# Altium project UM-1.PrjPcb
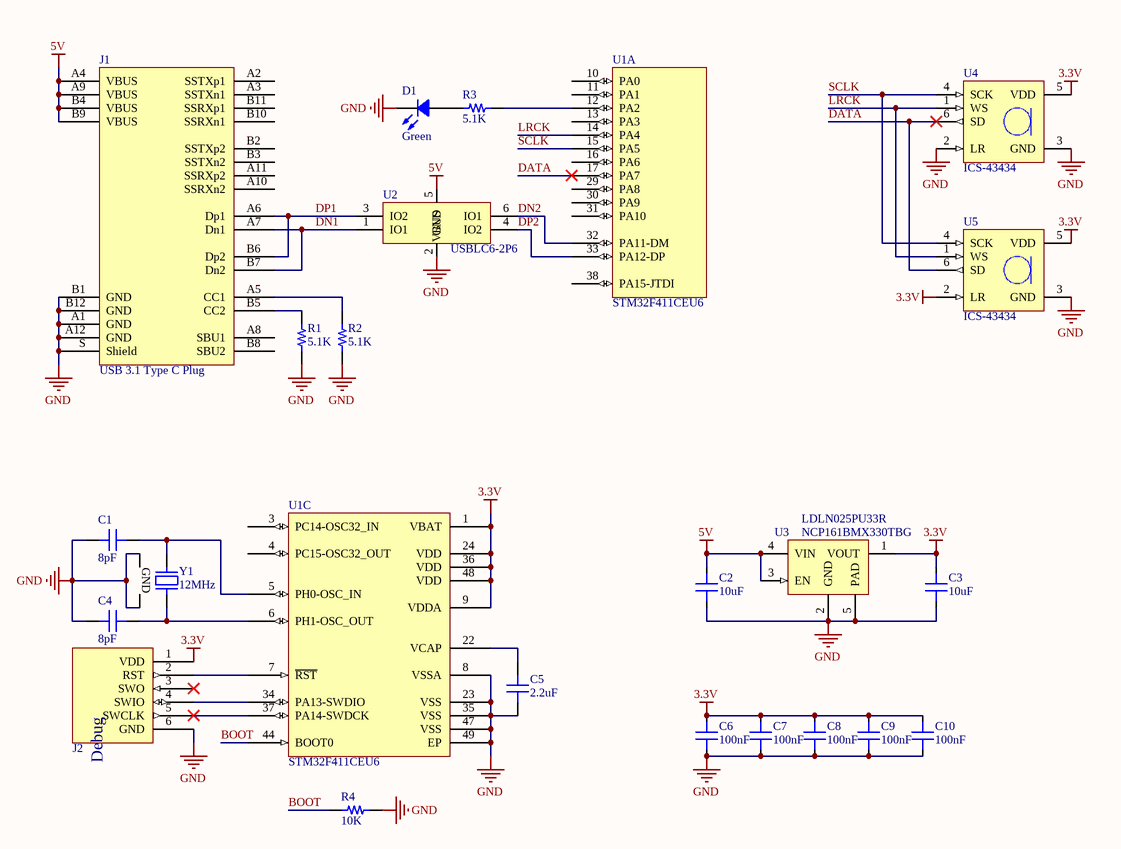
[diagram p0: UM-1.SchDoc]
1 sheet, 23 parts. Net scope: global (net labels, ports and power ports of the same name join across sheets).
Board file: UM-1.PcbDoc

## Sheet UM-1.SchDoc: UM-1
size A4; Organization: OGGA SAS; Address1: 96 Bd Marius Vivier Merle; Address2: 69003 Lyon; Address3: France; SheetNumber: 1; SheetTotal: 1

### Parts
C1  8pF  [CAP 0402/1005]
C2  10uF  [CAP 0603/1608]
C3  10uF  [CAP 0603/1608]
C4  8pF  [CAP 0402/1005]
C5  2.2uF  [CAP 0402/1005]
C6  100nF  [CAP 0402/1005]
C7  100nF  [CAP 0402/1005]
C8  100nF  [CAP 0402/1005]
C9  100nF  [CAP 0402/1005]
C10  100nF  [CAP 0402/1005]
D1  Green  [LED 0402/1005 GREEN]
J1  USB 3.1 Type C Plug  [632712000112]
J2  SWD Port  [DBG_6PX127 SMD]  (value not drawn)  (no BOM)
R1  5.1K  [RES 0402/1005]
R2  5.1K  [RES 0402/1005]
R3  5.1K  [RES 0402/1005]
R4  10K  [RES 0402/1005]
U1  STM32F411CEU6  [QFN50P700X700X60_HS-49N]  (parts A,C of 3)
U2  USBLC6-2P6  [SOTFL50P160X60-6N]
U3  LDLN025PU33R  Alt Part: NCP161BMX330TBG  [XDFN65P100X45-4N]
U4  ICS-43434  [TDK ICS-43434]
U5  ICS-43434  [TDK ICS-43434]
Y1  12MHz  [NDK NZ2520SD]

### Nets
3.3V: C3.2 C6.2 C7.2 C8.2 C9.2 C10.2 J2.1(VDD) U1.1(VBAT) U1.9(VDDA) U1.24(VDD) U1.36(VDD) U1.48(VDD) U3.1(VOUT) U4.5(VDD) U5.2(LR) U5.5(VDD)
5V: C2.2 J1.A4(VBUS) J1.A9(VBUS) J1.B4(VBUS) J1.B9(VBUS) U2.5(VBUS) U3.3(EN) U3.4(VIN)
GND: C1.1 C2.1 C3.1 C4.1 C5.1 C6.1 C7.1 C8.1 C9.1 C10.1 D1.2 J1.A1(GND) J1.A12(GND) J1.B1(GND) J1.B12(GND) J1.S(Shield) J2.6(GND) R1.1 R2.1 R4.2 U1.8(VSSA) U1.23(VSS) U1.35(VSS) U1.47(VSS) U1.49(EP) U2.2(GND) U3.2(GND) U3.5(PAD) U4.2(LR) U4.3(GND) U5.3(GND) Y1.2(GND) Y1.4(GND)
BOOT: R4.1 U1.44(BOOT0)
DATA: U1.17(PA7) U4.6(SD) U5.6(SD)
DN1: J1.A7(Dn1) J1.B7(Dn2) U2.1(IO1)
DN2: U1.32(PA11-DM) U2.6(IO1)
DP1: J1.A6(Dp1) J1.B6(Dp2) U2.3(IO2)
DP2: U1.33(PA12-DP) U2.4(IO2)
LRCK: U1.14(PA4) U4.1(WS) U5.1(WS)
SCLK: U1.15(PA5) U4.4(SCK) U5.4(SCK)
NetC1_2: C1.2 U1.5(PH0-OSC_IN) Y1.1
NetC4_2: C4.2 U1.6(PH1-OSC_OUT) Y1.3
NetC5_2: C5.2 U1.22(VCAP)
NetD1_1: D1.1 R3.2
NetJ1_A5: J1.A5(CC1) R2.2
NetJ1_B5: J1.B5(CC2) R1.2
NetJ2_2: J2.2(RST) U1.7(~{RST})
NetJ2_4: J2.4(SWIO) U1.34(PA13-SWDIO)
NetJ2_5: J2.5(SWCLK) U1.37(PA14-SWDCK)
NetR3_1: R3.1 U1.12(PA2)

Not connected (* = marked no-connect by the designer): J1 A2(SSTXp1) A3(SSTXn1) A8(SBU1) A10(SSRXn2) A11(SSRXp2) B2(SSTXp2) B3(SSTXn2) B8(SBU2) B10(SSRXn1) B11(SSRXp1); J2 3(SWO)*; U1 3(PC14-OSC32_IN) 4(PC15-OSC32_OUT) 10(PA0) 11(PA1) 13(PA3) 16(PA6) 29(PA8) 30(PA9) 31(PA10) 38(PA15-JTDI)

### Notes on the sheet
- Title
- Size:
- Date:
- A4
- Number:
- Time:
- Revision:
- Sheet
- of
- File:
- (in symbol SWD Port) Debug

### Library data of the parts
C1 C4 = CM0143: CAP CER 8PF 50V NP0 0402; Part Number: GRM1555C1H8R0BA01D; Manufacturer: Murata; TemperatureRange: -55C ~ 125C; TemperatureCoefficient: C0G, NP0; Tolerance: 0.1pF; PartId: CM0143; Value: 8pF; Supplier 1: Digi-Key; Supplier Part Number 1: 490-8230-2-ND; ComponentLink1Description: Datasheet; ComponentLink1URL: http://www.murata.com/~/media/webrenewal/support/library/catalog/products/capacitor/mlcc/c02e.ashx; ComponentLink2Description: Digi-Key listing; ComponentLink2URL: http://digikey.com/product-detail/en/GRM1555C1H8R0BA01D/490-8230-2-ND/3694033; Voltage: 50V; Price: 0.0108; Type: -; Device Package: 0402 (1005 Metric)
C2 C3 = CM0905: CAP CER 10UF 25V X5R 0603; Part Number: GRM188R61E106MA73D; Manufacturer: Murata; TemperatureRange: -55C ~ 85C; Tolerance: 20%; Value: 10uF; PartId: CM0905; Supplier 1: Digi-Key; Supplier Part Number 1: 490-7202-2-ND; ComponentLink1Description: Datasheet; ComponentLink1URL: http://www.murata.com/~/media/webrenewal/support/library/catalog/products/capacitor/mlcc/c02e.pdf; ComponentLink2Description: Digi-Key Listing; ComponentLink2URL: https://www.digikey.com/product-detail/en/murata-electronics-north-america/GRM188R61E106MA73D/490-7202-2-ND/3900497; TemperatureCoefficient: X5R; Voltage: 25V; Price: 0.0858; Device Package: 0603 (1608 Metric)
C5 = CM0503: CAP CER 2.2UF 10V X5R 0402; Part Number: GRM155R61A225ME95D; Manufacturer: Murata Electronics North America; TemperatureRange: -55C ~ 85C; Tolerance: 20%; va: 2200000; Value: 2.2uF; PartId: CM0503; Supplier 1: Digi-Key; Supplier Part Number 1: 490-10452-2-ND; ComponentLink1Description: Datasheet; ComponentLink1URL: http://www.murata.com/~/media/webrenewal/support/library/catalog/products/capacitor/mlcc/c02e.pdf; ComponentLink2Description: Digi-Key Listing; ComponentLink2URL: https://www.digikey.com/product-detail/en/murata-electronics-north-america/GRM155R61A225ME95D/490-10452-2-ND/5027537; TemperatureCoefficient: X5R; Voltage: 10V; Price: 0.0151; Device Package: 0402 (1005 Metric)
C6-C10 = CM0464: CAP CER 100NF 25V X5R 0402; Part Number: GRM155R61E104KA87D; Manufacturer: Murata; TemperatureRange: -55C ~ 85C; Tolerance: 10%; PartId: CM0464; Value: 100nF; Supplier 1: Digi-Key; Supplier Part Number 1: 490-5920-2-ND; ComponentLink1Description: Datasheet; ComponentLink1URL: http://www.murata.com/~/media/webrenewal/support/library/catalog/products/capacitor/mlcc/c02e.pdf; TemperatureCoefficient: X5R; Voltage: 25V; Price: 0.0048; Device Package: 0402 (1005 Metric); ComponentLink2Description: Digi-Key Listing; ComponentLink2URL: https://www.digikey.com/product-detail/en/murata-electronics-north-america/GRM155R61E104KA87D/490-5920-2-ND/3693681
D1 = LS0063: LED GREEN DIFFUSED 0402 SMD; Part Number: HSMG-C280; Manufacturer: Avago Technologies US Inc.; Type: Surface Mount; Millicandela: 15mcd; Voltage Forward: 2.2V; Current (Test): 20mA; Viewing Angle: 130; Value: Green; Colour: Green; PartId: LS0063; Supplier 1: Digi-Key; Supplier Part Number 1: 516-3066-2-ND; ComponentLink1Description: Datasheet; ComponentLink1URL: http://www.avagotech.com/docs/AV02-0602EN; ComponentLink2Description: Digi-Key Listing; ComponentLink2URL: http://www.digikey.ca/product-detail/en/HSMG-C280/516-3066-2-ND/1235358; Price: 0.1147; Device Package: 0402 (1005 Metric); Lens Transparency: Diffused
J1 = CU0054: USB 3.1 Type C, Plug, Horizontal, SMT; Manufacturer: Wurth; Number Of Positions: 24; PartId: CU0054; Part Number: 632712000112; Supplier 1: Mouser; Supplier Part Number 1: 710-632712000112; ComponentLink1Description: Datasheet; ComponentLink1URL: https://katalog.we-online.com/em/datasheet/632712000112.pdf; Type: USB - C
J2 = SWD Port: 6 Pin SWD Connector; Part Number: SWD Port; Component Type: Standard (No BOM); Pin Count: 6
R1-R3 = RC1489: RES SMD 5.1K OHM 5% 1/16W 0402; Part Number: RC0402JR-075K1L; Manufacturer: Yageo; TemperatureRange: -55C ~ 155C; TemperatureCoefficient: 100ppm/C; PowerRating: 0.0625W, 1/16W; Value: 5.1K; PartId: RC1489; Supplier 1: Mouser; Supplier Part Number 1: 603-RC0402JR-075K1L; ComponentLink1Description: Datasheet; ComponentLink1URL: http://www.yageo.com/NewPortal/yageodocoutput?fileName=/pdf/R-Chip/PYu-RC_Group_51_RoHS_L_9.pdf; Tolerance: 5%; Price: 0.0043; Type: Thick Film; Device Package: 0402 (1005 Metric)
R4 = RC1530: RES SMD 10K OHM 5% 1/16W 0402; Part Number: RC0402JR-0710KL; Manufacturer: Yageo; TemperatureRange: -55C ~ 155C; TemperatureCoefficient: 100ppm/C; PowerRating: 0.0625W, 1/16W; PartId: RC1530; Value: 10K; Supplier 1: Mouser; Supplier Part Number 1: 603-RC0402JR-0710KL; ComponentLink1Description: Datasheet; ComponentLink1URL: http://www.yageo.com/NewPortal/yageodocoutput?fileName=/pdf/R-Chip/PYu-RC_Group_51_RoHS_L_9.pdf; Tolerance: 5%; Price: 0.0043; Type: Thick Film; Device Package: 0402 (1005 Metric)
U1 = US3028: 32-bit MCU, 512KB Flash, 128KB RAM, USB; Manufacturer: ST; PartId: US3028; Part Number: STM32F411CEU6; Supplier 1: Digi-Key; Supplier Part Number 1: 497-14907-ND / 497-14907-ND / 497-14907-ND; Supplier 2: Mouser; Supplier Part Number 2: 511-STM32F411CEU6; ComponentLink1Description: Datasheet; ComponentLink1URL: https://www.st.com/resource/en/datasheet/stm32f411ce.pdf; Price: 4; Type: MCU; Device Package: 48-QFN (7x7); Operating Temperature: -40C ~ 85C
U2 = IIF001: TVS ARRAY SOT666; Manufacturer: ST; PartId: IIF001; Part Number: USBLC6-2P6; Supplier 1: Digi-Key; Supplier Part Number 1: 497-5026-1-ND; Supplier 2: Farnell; Supplier Part Number 2: 1295310; ComponentLink1Description: Datasheet; ComponentLink1URL: http://www.st.com/resource/en/datasheet/usblc6-2.pdf; Price: 0.58; Type: ESD Diode; Device Package: SOTFL-6; Operating Temperature: -40C ~ 125C
U3 = URL069: 3.3V 250mA Ultra Low Noise LDO; Manufacturer: ST; Input Voltage MAX: 5.5V; PartId: URL069; Part Number: LDLN025PU33R; Supplier 1: Digi-Key; Supplier Part Number 1: 497-17003-2-ND; Supplier 2: Mouser; Supplier Part Number 2: 511-LDLN025PU33R; ComponentLink1Description: Datasheet; ComponentLink1URL: http://www.st.com/resource/en/datasheet/ldln025.pdf; Price: 0.2295; Type: LDO; Device Package: 4-XDFN; Operating Temperature: -40C ~ 125C; Output Voltage: 3.3V; Output Current: 250mA
U4 U5 = UA0012: MICROPHONE MEMS DIGITAL I2S OMNI; Manufacturer: TDK; Package: None; MP: ICS-43434; Value: *; Price: 2; Availability: Unavailable; PartId: UA0012; Part Number: ICS-43434; Supplier 1: Digi-Key; Supplier Part Number 1: 1428-1066-2-ND; Supplier 2: Mouser; Supplier Part Number 2: 410-ICS-43434; ComponentLink1Description: Datasheet; ComponentLink1URL: https://invensense.tdk.com/wp-content/uploads/2016/02/DS-000069-ICS-43434-v1.2.pdf; Type: MEMS MIC; Operating Temperature: -40C ~ 85C
Y1 = OC0706: CRYSTAL 12MHZ 12PF SMD; Part Number: ECS-120-12-36Q-CWY-TR; Manufacturer: ECS; Frequency Tolerance: 10ppm; PartId: OC0706; Value: 12MHz; Supplier 1: Digi-Key; Supplier Part Number 1: XC2419CT-ND; ComponentLink1Description: Datasheet; ComponentLink1URL: https://ecsxtal.com/store/pdf/ECX-2236Q.pdf; Supplier 2: Mouser; Supplier Part Number 2: 520-120-12-36Q-CWYT; Type: MHz Crystal; Device Package: 4-SMD, No Lead (DFN, LCC; Series: ECX-2236Q; Frequency: 12MHz; Frequency Stability: -; Load Capacitance: 12pF